# EAGLE schematic tiu_tracking_detector (EAGLE 5.11)
ABBREV: jn5; PROJECT: JeeNode v5
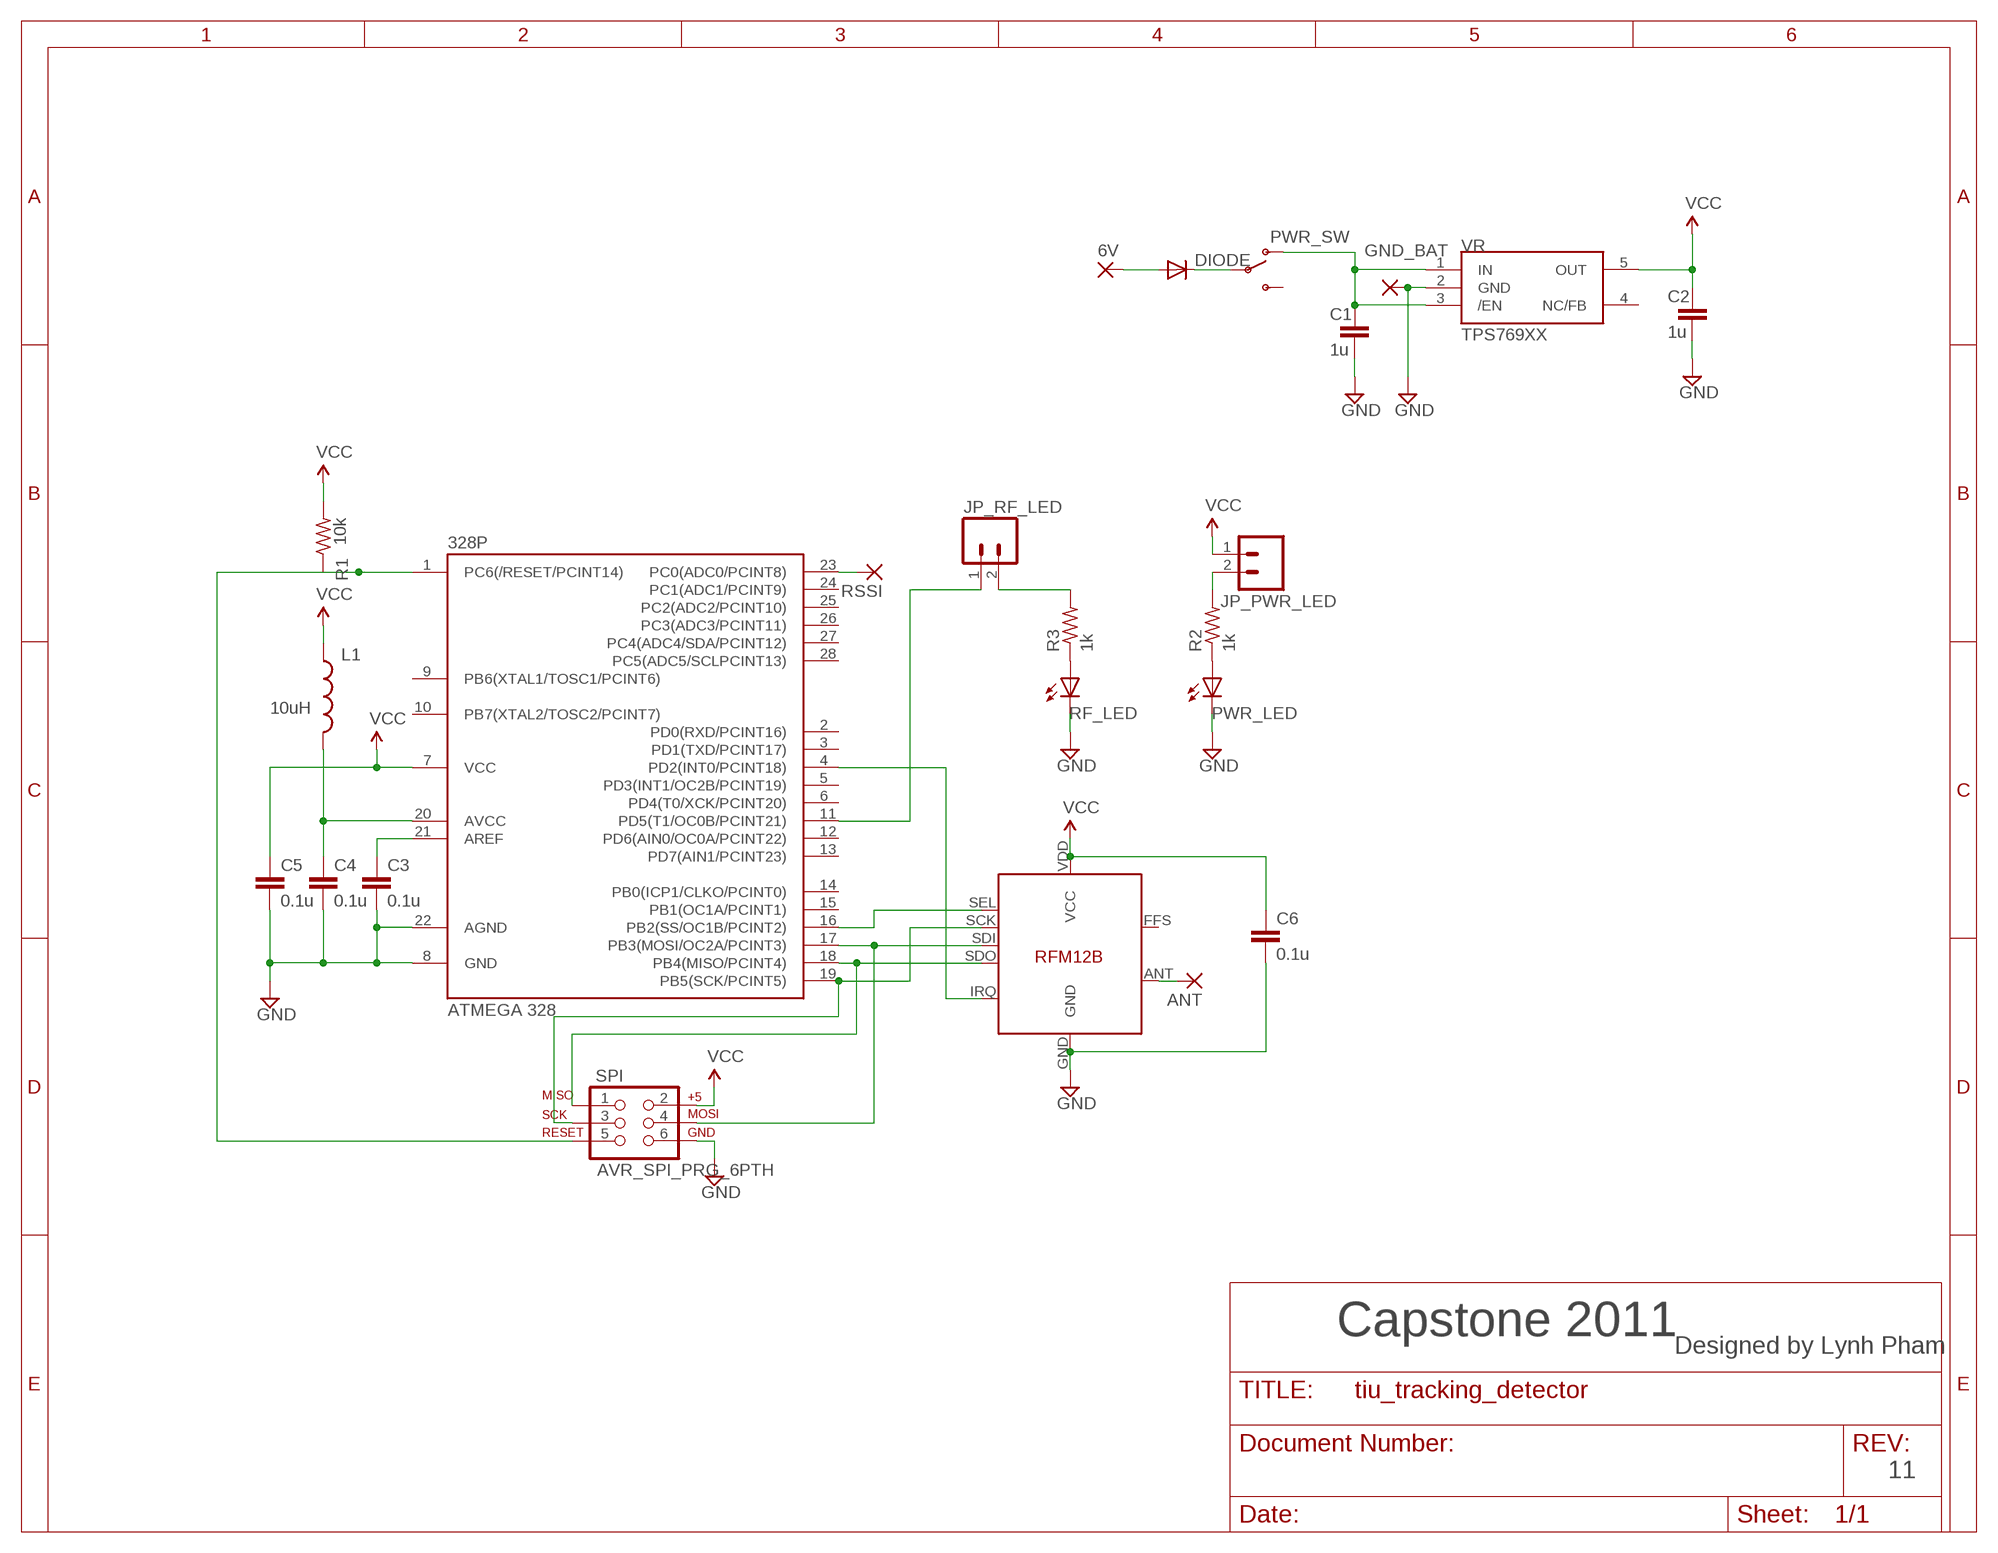
[diagram p0: schematic, sheet 1]

## Parts
6V  1,6/0,8  [1,6/0,8]
328P  ATMEGA 328  ATMEGA48/88/168-PU  [DIL28-3]
ANT  1,6/0,8  [1,6/0,8]
C1  1u  CAP0805  [0805]
C2  1u  CAP0805  [0805]
C3  0.1u  CAP0805  [0805]
C4  0.1u  CAP0805  [0805]
C5  0.1u  CAP0805  [0805]
C6  0.1u  CAP0805  [0805]
DIODE  DIODESOD  [SOD-323]
FRM12B  RFM12B  [RFM12B]
GND_BAT  1,6/0,8  [1,6/0,8]
JP_PWR_LED  M02PTH  [1X02]
JP_RF_LED  M02PTH  [1X02]
L1  10uH  INDUCTOR1210  [1210]
PWR_LED  LED3MM  [LED3MM]
PWR_SW  SWITCH-SPSTPTH  [SWITCH-SPDT]
R1  10k  R-US_M0805  [M0805]
R2  1k  R-US_M1206  [M1206]
R3  1k  R-US_M1206  [M1206]
RF_LED  LED3MM  [LED3MM]
RSSI  1,6/0,8  [1,6/0,8]
SPI  AVR_SPI_PRG_6PTH  [2X3]
VR  TPS769XX  [SOT23-5L]

## Nets
GND [power]: 328P.8(GND) 328P.22(AGND) C1.2 C2.2 C3.2 C4.2 C5.2 C6.2 FRM12B.GND GND_BAT.1(P) PWR_LED.K(C) RF_LED.K(C) SPI.6 VR.2(GND)
N$1: 328P.1(PC6(/RESET/PCINT14)) R1.1 SPI.5
N$2: 328P.18(PB4(MISO/PCINT4)) FRM12B.SDO SPI.1
N$3: 328P.17(PB3(MOSI/OC2A/PCINT3)) FRM12B.SDI SPI.4
N$4: 328P.16(PB2(SS/OC1B/PCINT2)) FRM12B.SEL
N$5: 328P.19(PB5(SCK/PCINT5)) FRM12B.SCK SPI.3
N$6: 328P.23(PC0(ADC0/PCINT8)) RSSI.1(P)
N$7: 328P.4(PD2(INT0/PCINT18)) FRM12B.IRQ
N$8: 6V.1(P) DIODE.2(A)
N$9: DIODE.1(C) PWR_SW.2(P)
N$10: C1.1 PWR_SW.1(O) VR.1(IN) VR.3(/EN)
N$11: PWR_LED.A R2.1
N$12: R3.1 RF_LED.A
N$13: ANT.1(P) FRM12B.ANT
N$14: 328P.11(PD5(T1/OC0B/PCINT21)) JP_RF_LED.1
N$15: JP_RF_LED.2 R3.2
N$16: JP_PWR_LED.2 R2.2
N$17 [power]: 328P.20(AVCC) C4.1 L1.2
N$19: 328P.21(AREF) C3.1
VCC [power]: 328P.7(VCC) C2.1 C5.1 C6.1 FRM12B.VDD(VCC) JP_PWR_LED.1 L1.1 R1.2 SPI.2 VR.5(OUT)
Unconnected: 328P.2(PD0(RXD/PCINT16)) 328P.3(PD1(TXD/PCINT17)) 328P.5(PD3(INT1/OC2B/PCINT19)) 328P.6(PD4(T0/XCK/PCINT20)) 328P.9(PB6(XTAL1/TOSC1/PCINT6)) 328P.10(PB7(XTAL2/TOSC2/PCINT7)) 328P.12(PD6(AIN0/OC0A/PCINT22)) 328P.13(PD7(AIN1/PCINT23)) 328P.14(PB0(ICP1/CLKO/PCINT0)) 328P.15(PB1(OC1A/PCINT1)) 328P.24(PC1(ADC1/PCINT9)) 328P.25(PC2(ADC2/PCINT10)) 328P.26(PC3(ADC3/PCINT11)) 328P.27(PC4(ADC4/SDA/PCINT12)) 328P.28(PC5(ADC5/SCLPCINT13)) FRM12B.FFS PWR_SW.3(S) VR.4(NC/FB)

## Notes on the sheet
- Capstone 2011
- Designed by Lynh Pham
- 11

## Library data of the parts
6V ANT GND_BAT RSSI = JeeLabs:1,6/0,8: THROUGH-HOLE PAD
328P = atmega8:ATMEGA48/88/168-PU
C1-C6 = SparkFun:CAP: Capacitor Standard 0603 ceramic capacitor, and 0.1" leaded capacitor.
DIODE = SparkFun:DIODE: Diode These are standard reverse protection diodes and small signal diodes. SMA package can handle up to about 1A. SOD-323 can handle about 200mA. What the SOD-323 package when ordering, there are some mfgs out there that are 5-pin packages.
FRM12B = JeeLabs:RFM12B
JP_PWR_LED JP_RF_LED = SparkFun:M02: Header 2 Standard 2-pin 0.1" header. Use with straight break away headers (SKU : PRT-00116), right angle break away headers (PRT-00553), swiss pins (PRT-00743), machine pins (PRT-00117), and female headers (PRT-00115). Molex polarized connector foot print use with SKU : PRT-08233 with associated crimp pins and housings.
L1 = SparkFun:INDUCTOR: Inductors Basic Inductor/Choke - 0603 and 1206. Footprints are not proven and vary greatly between part numbers.
PWR_LED RF_LED = SparkFun:LED: LEDs Standard schematic elements and footprints for 5mm, 3mm, 1206, and 0603 sized LEDs. 5mm - Spark Fun Electronics SKU : COM-00529 (and others)
PWR_SW = SparkFun:SWITCH-SPST: SPST Switch Simple slide switch. Spark Fun Electronics SKU : COM-00102
R1-R3 = resistor:R-US_: RESISTOR, American symbol
SPI = SparkFun:AVR_SPI_PRG_6: AVR ISP 6 Pin This is the reduced ISP connector for AVR programming. Common on Arduino. This footprint will take up less PCB space and can be used with a 10-pin to 6-pin adapter such as SKU: BOB-08508
VR = tps769xx:TPS769XX

## Net classes
1 power: width 0.381 mm, clearance 0.254 mm